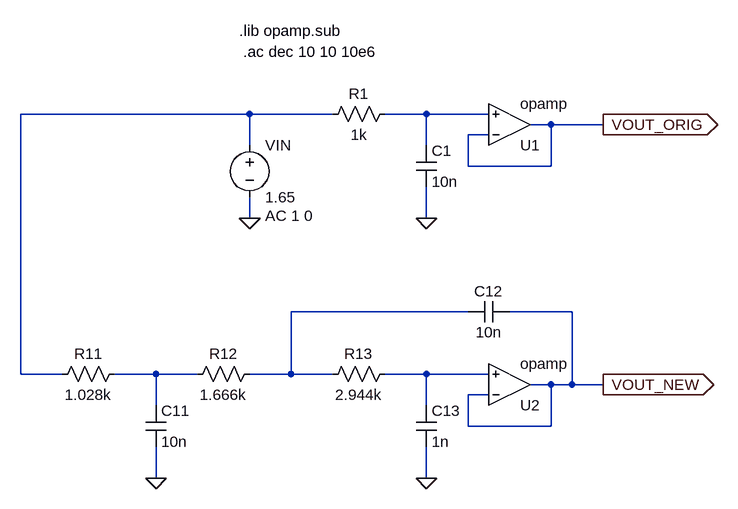
[diagram p0: schematic filter.asc]
filter.asc, the LTspice schematic file:
Version 4
SHEET 1 880 692
WIRE -192 112 -544 112
WIRE -64 112 -192 112
WIRE 80 112 16 112
WIRE 176 112 80 112
WIRE 272 128 240 128
WIRE 352 128 272 128
WIRE 176 144 144 144
WIRE -192 160 -192 112
WIRE 80 160 80 112
WIRE 144 192 144 144
WIRE 272 192 272 128
WIRE 272 192 144 192
WIRE -192 272 -192 240
WIRE 80 272 80 224
WIRE 144 416 -128 416
WIRE 304 416 208 416
WIRE -544 512 -544 112
WIRE -480 512 -544 512
WIRE -336 512 -400 512
WIRE -272 512 -336 512
WIRE -128 512 -128 416
WIRE -128 512 -192 512
WIRE -64 512 -128 512
WIRE 80 512 16 512
WIRE 176 512 80 512
WIRE 272 528 240 528
WIRE 304 528 304 416
WIRE 304 528 272 528
WIRE 352 528 304 528
WIRE 176 544 144 544
WIRE -336 560 -336 512
WIRE 80 560 80 512
WIRE 144 592 144 544
WIRE 272 592 272 528
WIRE 272 592 144 592
WIRE -336 672 -336 624
WIRE 80 672 80 624
FLAG 80 272 0
FLAG -192 272 0
FLAG 352 128 VOUT_ORIG
IOPIN 352 128 Out
FLAG 80 672 0
FLAG 352 528 VOUT_NEW
IOPIN 352 528 Out
FLAG -336 672 0
SYMBOL Opamps\\opamp 208 192 M180
SYMATTR InstName U1
SYMBOL res -80 128 R270
WINDOW 0 32 56 VTop 2
WINDOW 3 0 56 VBottom 2
SYMATTR InstName R1
SYMATTR Value 1k
SYMBOL cap 64 160 R0
SYMATTR InstName C1
SYMATTR Value 10n
SYMBOL voltage -192 144 R0
WINDOW 123 24 124 Left 2
WINDOW 39 0 0 Left 2
SYMATTR InstName VIN
SYMATTR Value 1.65
SYMATTR Value2 AC 1 0
SYMBOL Opamps\\opamp 208 592 M180
SYMATTR InstName U2
SYMBOL res -80 528 R270
WINDOW 0 32 56 VTop 2
WINDOW 3 0 56 VBottom 2
SYMATTR InstName R13
SYMATTR Value 2.944k
SYMBOL cap 64 560 R0
SYMATTR InstName C13
SYMATTR Value 1n
SYMBOL res -496 528 R270
WINDOW 0 32 56 VTop 2
WINDOW 3 0 56 VBottom 2
SYMATTR InstName R11
SYMATTR Value 1.028k
SYMBOL cap -352 560 R0
SYMATTR InstName C11
SYMATTR Value 10n
SYMBOL res -288 528 R270
WINDOW 0 32 56 VTop 2
WINDOW 3 0 56 VBottom 2
SYMATTR InstName R12
SYMATTR Value 1.666k
SYMBOL cap 144 432 R270
WINDOW 0 32 32 VTop 2
WINDOW 3 0 32 VBottom 2
SYMATTR InstName C12
SYMATTR Value 10n
TEXT -202 16 Left 2 !.ac dec 10 10 10e6
TEXT -208 -16 Left 2 !.lib opamp.sub

The netlist it stands for:
* filter.asc
XU1 VOUT_ORIG N002 VOUT_ORIG opamp Aol=100K GBW=10Meg  ; pins invin noninvin out
R1 N001 N002 1k
C1 N002 0 10n
VIN N001 0 1.65 AC 1 0
XU2 VOUT_NEW N005 VOUT_NEW opamp Aol=100K GBW=10Meg  ; pins invin noninvin out
R13 N003 N005 2.944k
C13 N005 0 1n
R11 N001 N004 1.028k
C11 N004 0 10n
R12 N004 N003 1.666k
C12 N003 VOUT_NEW 10n
.ac dec 10 10 10e6
.lib opamp.sub
.backanno
.end